# EAGLE design PLL (EAGLE 6.4)
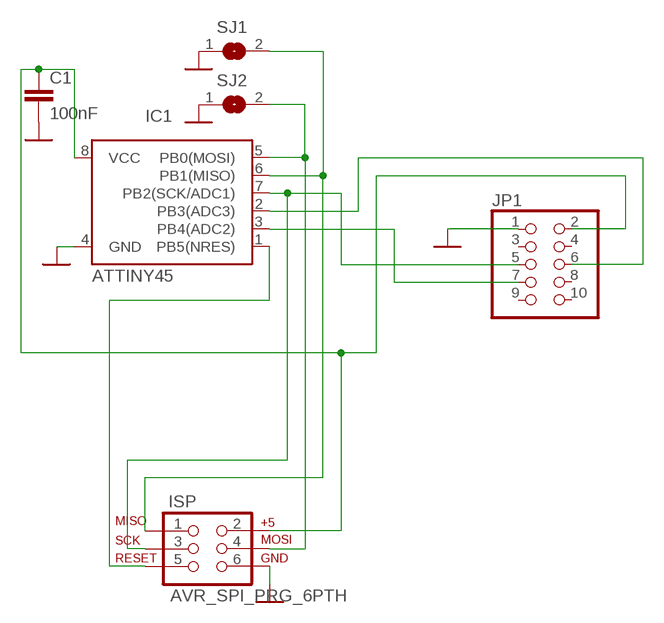
[diagram p0: schematic, sheet 1]

## Parts
C1  100nF  C-EUC0805  [C0805]
IC1  ATTINY45  [SO08-EIAJ]
ISP  AVR_SPI_PRG_6PTH  [2X3]
JP1  PINHD-2X5  [2X05]
SJ1  SJ  [SJ]
SJ2  SJ  [SJ]

## Nets
GND: C1.2 IC1.4(GND) ISP.6 JP1.1 SJ1.1 SJ2.1
ISP: IC1.7(PB2(SCK/ADC1)) ISP.3 JP1.5
N$1: IC1.3(PB4(ADC2)) JP1.7
N$2: IC1.2(PB3(ADC3)) JP1.6
N$5: C1.1 IC1.8(VCC) ISP.2 JP1.2
N$9: IC1.6(PB1(MISO)) ISP.1 SJ1.2
N$10: IC1.5(PB0(MOSI)) ISP.4 SJ2.2
N$16: IC1.1(PB5(NRES)) ISP.5
Unconnected: JP1.3 JP1.4 JP1.8 JP1.9 JP1.10

## Library data of the parts
C1 = rcl:C-EU: CAPACITOR, European symbol
IC1 = sparkfun:ATTINY45: Atmel ATTiny45
ISP = sparkfun:AVR_SPI_PRG_6: AVR ISP 6 Pin This is the reduced ISP connector for AVR programming. Common on Arduino. This footprint will take up less PCB space and can be used with a 10-pin to 6-pin adapter such as SKU: BOB-08508
JP1 = pinhead:PINHD-2X5: PIN HEADER
SJ1 SJ2 = jumper:SJ: SMD solder JUMPER

## Board
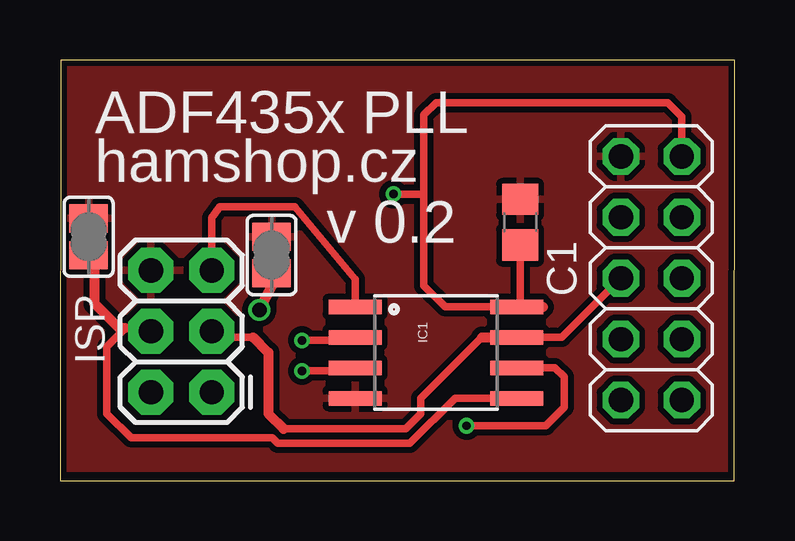
[diagram p1: board, top side]
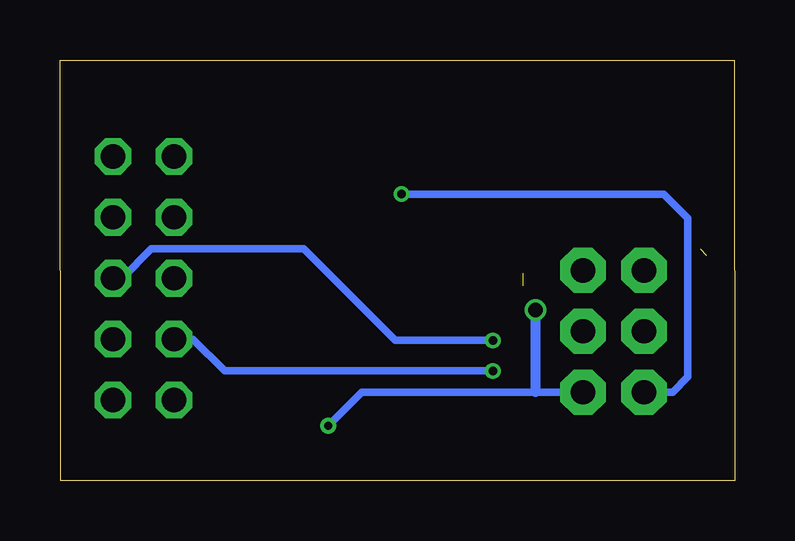
[diagram p2: board, bottom side, seen from below]

Size 28.12 x 17.53 mm. Coordinates in mm from the lower left corner, seen from the top.
Outline: 0.03,17.53 0,0 28.09,0 28.12,17.53 0.03,17.53
Copper layers (1*16): Top 0.035mm / dielectric 1.5mm / Bottom 0.035mm
Design rules "Fusion_eagle_rule_v1.1 *": minimum track width 6mil, minimum drill 12mil, track to track 10mil, track to pad 10mil, pad to pad 6mil, via to via 6mil, smd to smd 0mil, copper to edge 10mil, drill to drill 10mil, minimum pad ring 10mil, minimum via ring 6mil, stop-mask expansion 2mil, vias tented up to drill 100mil, thermal gap 10mil

### Footprints (pad centres in the part's own frame; a part is rotated, then mirrored left to right if it is on the bottom)
C0805 = smd 1.3 x 1.5: 1 -0.95,0; 2 0.95,0
SO08-EIAJ = smd 0.61 x 2.21: 1 -1.905,-3.378; 2 -0.635,-3.378; 3 0.635,-3.378; 4 1.905,-3.378; 5 1.905,3.353; 6 0.635,3.353; 7 -0.635,3.353; 8 -1.905,3.353
2X3 = drill 1.016 pad 1.88 octagon: 1 0,0; 2 0,2.54; 3 2.54,0; 4 2.54,2.54; 5 5.08,0; 6 5.08,2.54
2X05 = drill 1.016 octagon: 1 -5.08,-1.27; 2 -5.08,1.27; 3 -2.54,-1.27; 4 -2.54,1.27; 5 0,-1.27; 6 0,1.27; 7 2.54,-1.27; 8 2.54,1.27; 9 5.08,-1.27; 10 5.08,1.27
SJ = smd 1.168 x 1.6: 1 -0.762,0; 2 0.762,0

### Placement (x,y rotation side)
C1  19.18,10.77 90 top
IC1  15.67,5.33 270 top
ISP  6.32,3.68 90 top
JP1  24.64,8.43 270 top
SJ1  8.81,9.4 270 top
SJ2  1.19,10.16 270 top

### Tracks (layer width: path | path; a pad name or v marks a point on that pad's centre or on a via)
GND
  pour Top: 0.18,17.27 27.86,17.27 27.86,0.51 0.18,0.51
ISP
  Top 0.305: 17.58,5.97 15.04,3.43 15.04,2.79 14.4,2.16 9.32,2.16 | 8.05,5.97 6.32,5.97 ISP.3 | IC1.7 20.9,5.97 JP1.5
  Top 0.406: 17.58,5.97 IC1.7 | 9.32,2.16 8.69,2.79 8.69,5.33 8.05,5.97
N$1  (via drill 0.35)
  Top 0.305: v10.08,4.57 12.17,4.57 IC1.3
  Bottom 0.305: JP1.7 22.58,5.89 21.26,4.57 v10.08,4.57
N$2  (via drill 0.35)
  Top 0.305: v10.08,5.84 12.17,5.84 IC1.2
  Bottom 0.305: JP1.6 25.53,8.43 24.31,9.65 17.96,9.65 14.15,5.84 v10.08,5.84
N$5  (via drill 0.35)
  Top 0.305: JP1.2 25.91,15.16 25.32,15.75 15.67,15.75 15.16,15.24 15.16,11.94 | 15.16,11.94 15.16,8.13 16.05,7.24 19.23,7.24 19.18,7.29 C1.1 | v13.89,11.94 15.16,11.94
  Top 0.406: 20.12,7.24 19.23,7.24 IC1.8
  Bottom 0.305: ISP.2 2.59,3.68 1.96,4.32 1.96,10.92 2.97,11.94 v13.89,11.94
N$9  (via drill 0.35, 0.6)  (1 unrouted)
  Top 0.305: v16.94,2.29 20.24,2.29 21.01,3.05 21.01,4.32 20.62,4.7 IC1.6
  Top 0.406: 8.81,8.13 v8.31,7.11
  Bottom 0.305: ISP.1 8.31,3.68 15.54,3.68 v16.94,2.29
  Bottom 0.406: v8.31,7.11 8.31,3.68
N$10  (1 unrouted)
  Top 0.305: IC1.5 16.46,3.43 14.58,1.55 9.07,1.55 8.84,1.78 2.97,1.78 1.96,2.79 1.96,5.59 2.72,6.35 3.66,6.35 ISP.4
  Top 0.406: 2.72,6.35 2.46,6.35 1.45,7.37 1.45,9.65
N$16
  Top 0.305: IC1.1 12.29,8.38 9.78,11.4 6.65,11.4 6.32,10.95 ISP.5

### Text on the board
tPlace: ADF435x PLL | hamshop.cz | v 0.2